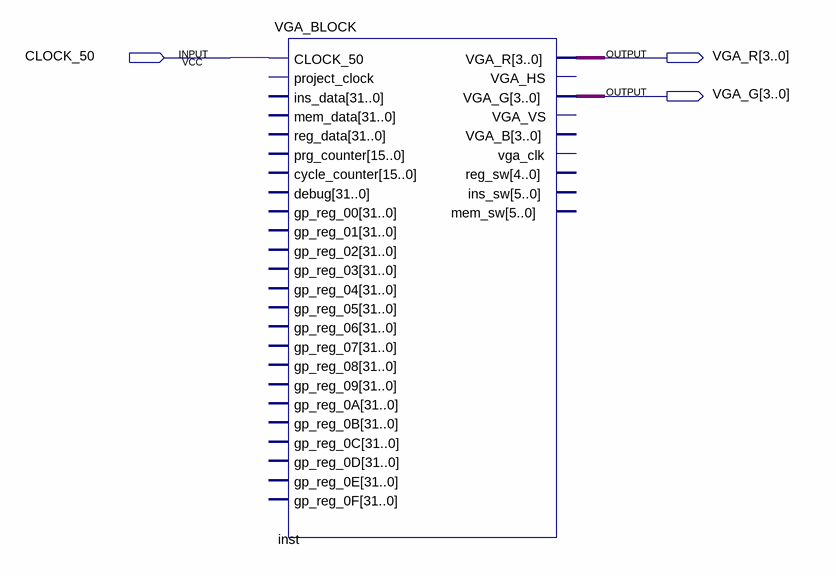
[diagram p0: schematic sheet]
// Quartus schematic file_name_yo.bdf as structural Verilog: 1 symbols, 3 pins
module file_name_yo (
  input  CLOCK_50,
  output [3:0] VGA_R,
  output [3:0] VGA_G
);

  VGA_BLOCK inst (
    .CLOCK_50(CLOCK_50), .VGA_R(VGA_R), .VGA_G(VGA_G));  // open: project_clock, ins_data, mem_data, reg_data, prg_counter, cycle_counter, debug, gp_reg_00, gp_reg_01, gp_reg_02, gp_reg_03, gp_reg_04, gp_reg_05, gp_reg_06, gp_reg_07, gp_reg_08, gp_reg_09, gp_reg_0A, gp_reg_0B, gp_reg_0C, gp_reg_0D, gp_reg_0E, gp_reg_0F, VGA_HS, VGA_VS, VGA_B, vga_clk, reg_sw, ins_sw, mem_sw
endmodule
